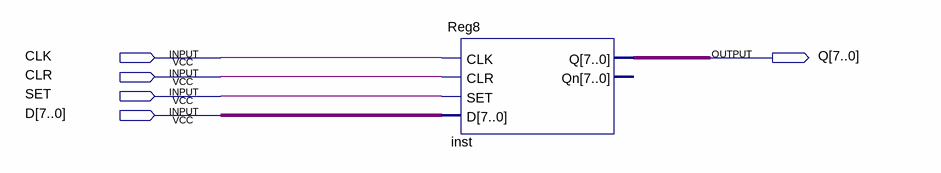
[diagram p0: schematic sheet]
// Quartus schematic Reg8.bdf as structural Verilog: 1 symbols, 5 pins
module Reg8 (
  input  CLK,
  input  CLR,
  input  SET,
  input  [7:0] D,
  output [7:0] Q
);

  Reg8 inst (.CLK(CLK), .CLR(CLR), .SET(SET), .D(D), .Q(Q));  // open: Qn
endmodule
